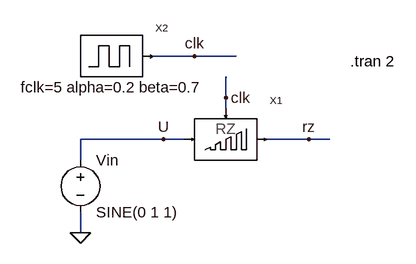
[diagram p0: schematic tb_return_to_zero.asc]
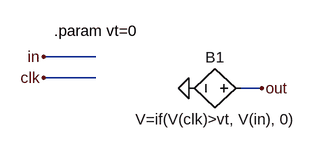
[diagram p1: sub-circuit return_to_zero.asc]
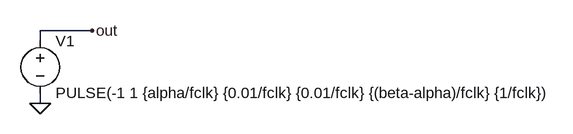
[diagram p2: sub-circuit clk.asc]
tb_return_to_zero.asc, the LTspice schematic file:
Version 4
SHEET 1 884 680
WIRE 32 32 -32 32
WIRE 96 32 32 32
WIRE 80 96 80 64
WIRE 80 112 80 96
WIRE -16 160 -144 160
WIRE 16 160 -16 160
WIRE 208 160 144 160
WIRE 240 160 208 160
WIRE -144 192 -144 160
WIRE -144 304 -144 272
FLAG 80 96 clk
FLAG -144 304 0
FLAG -16 160 U
FLAG 32 32 clk
FLAG 208 160 rz
SYMBOL voltage -144 176 R0
WINDOW 123 0 0 Left 2
WINDOW 39 0 0 Left 2
SYMATTR InstName Vin
SYMATTR Value SINE(0 1 1)
SYMBOL return_to_zero 80 160 R0
SYMATTR SpiceLine td=0.2
SYMATTR InstName X1
SYMBOL clk -96 32 R0
SYMATTR SpiceLine fclk=5 alpha=0.2 beta=0.7
SYMATTR InstName X2
TEXT 272 40 Left 2 !.tran 2

return_to_zero.asc, the sub-circuit schematic file:
Version 4
SHEET 1 880 680
WIRE 192 96 112 96
WIRE 192 128 112 128
WIRE 448 144 416 144
FLAG 112 96 in
FLAG 112 128 clk
FLAG 448 144 out
FLAG 336 144 0
SYMBOL bv 432 144 R90
WINDOW 0 -32 56 VBottom 2
WINDOW 3 32 56 VTop 2
SYMATTR InstName B1
SYMATTR Value V=if(V(clk)>vt, V(in), 0)
TEXT 128 56 Left 2 !.param vt=0

clk.asc, the sub-circuit schematic file:
Version 4
SHEET 1 1192 680
WIRE 448 144 368 144
WIRE 368 160 368 144
WIRE 368 256 368 240
FLAG 448 144 out
FLAG 368 256 0
SYMBOL voltage 368 144 R0
WINDOW 123 0 0 Left 2
WINDOW 39 0 0 Left 2
SYMATTR InstName V1
SYMATTR Value PULSE(-1 1 {alpha/fclk} {0.01/fclk} {0.01/fclk} {(beta-alpha)/fclk} {1/fclk})

The netlist it stands for:
* tb_return_to_zero.asc
Vin U 0 SINE(0 1 1)
XX1 U rz clk return_to_zero params: td=0.2
XX2 clk clk params: fclk=5 alpha=0.2 beta=0.7

* block symbol definitions
.subckt return_to_zero in out clk
B1 out 0 V=if(V(clk)>vt, V(in), 0)
.param vt=0
.ends return_to_zero

.subckt clk out
V1 out 0 PULSE(-1 1 {alpha/fclk} {0.01/fclk} {0.01/fclk} {(beta-alpha)/fclk} {1/fclk})
.ends clk

.tran 2
.backanno
.end